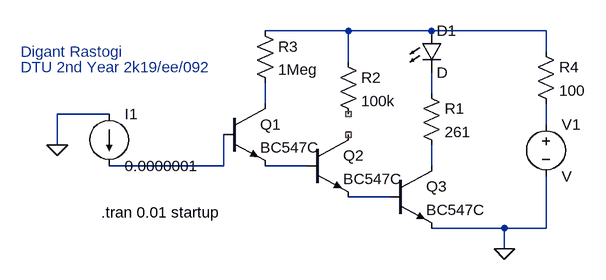
[diagram p0: schematic EDCProject.asc]
EDCProject.asc, the LTspice schematic file:
Version 4
SHEET 1 880 680
WIRE 240 16 112 16
WIRE 368 16 240 16
WIRE 544 16 368 16
WIRE 544 48 544 16
WIRE 240 64 240 16
WIRE 368 112 368 80
WIRE 112 128 112 96
WIRE -128 144 -208 144
WIRE 544 160 544 128
WIRE -208 192 -208 144
WIRE 48 224 48 176
WIRE 48 224 -128 224
WIRE 176 224 112 224
WIRE 368 224 368 192
WIRE 304 272 240 272
WIRE 480 320 368 320
WIRE 544 320 544 240
WIRE 544 320 480 320
WIRE 480 352 480 320
FLAG -208 192 0
FLAG 480 352 0
SYMBOL npn 48 128 R0
SYMATTR InstName Q1
SYMATTR Value BC547C
SYMBOL npn 176 176 R0
SYMATTR InstName Q2
SYMATTR Value BC547C
SYMBOL npn 304 224 R0
SYMATTR InstName Q3
SYMATTR Value BC547C
SYMBOL res 352 96 R0
SYMATTR InstName R1
SYMATTR Value 261
SYMBOL res 224 48 R0
SYMATTR InstName R2
SYMATTR Value 100k
SYMBOL res 96 0 R0
SYMATTR InstName R3
SYMATTR Value 1Meg
SYMBOL res 528 32 R0
SYMATTR InstName R4
SYMATTR Value 100
SYMBOL voltage 544 144 R0
SYMATTR InstName V1
SYMBOL LED 352 16 R0
SYMATTR InstName D1
SYMBOL current -128 144 R0
WINDOW 123 0 0 Left 0
WINDOW 39 0 0 Left 0
SYMATTR InstName I1
SYMATTR Value 0.0000001
TEXT -140 296 Left 2 !.tran 0.01 startup
TEXT -264 48 Left 2 ;Digant Rastogi
TEXT -264 72 Left 2 ;DTU 2nd Year 2k19/ee/092

The netlist it stands for:
* EDCProject.asc
Q1 N003 N005 N006 0 BC547C
Q2 NC_01 N006 N008 0 BC547C
Q3 N007 N008 0 0 BC547C
R1 N002 N007 261
R2 N001 NC_02 100k
R3 N001 N003 1Meg
R4 N001 N004 100
V1 N004 0 V
D1 N001 N002 D
I1 0 N005 0.0000001
.model D D
.lib standard.dio
.model NPN NPN
.model PNP PNP
.lib standard.bjt
.tran 0.01 startup
* Digant Rastogi
* DTU 2nd Year 2k19/ee/092
.backanno
.end